# EAGLE design nrf-ethernet (EAGLE 6.4)
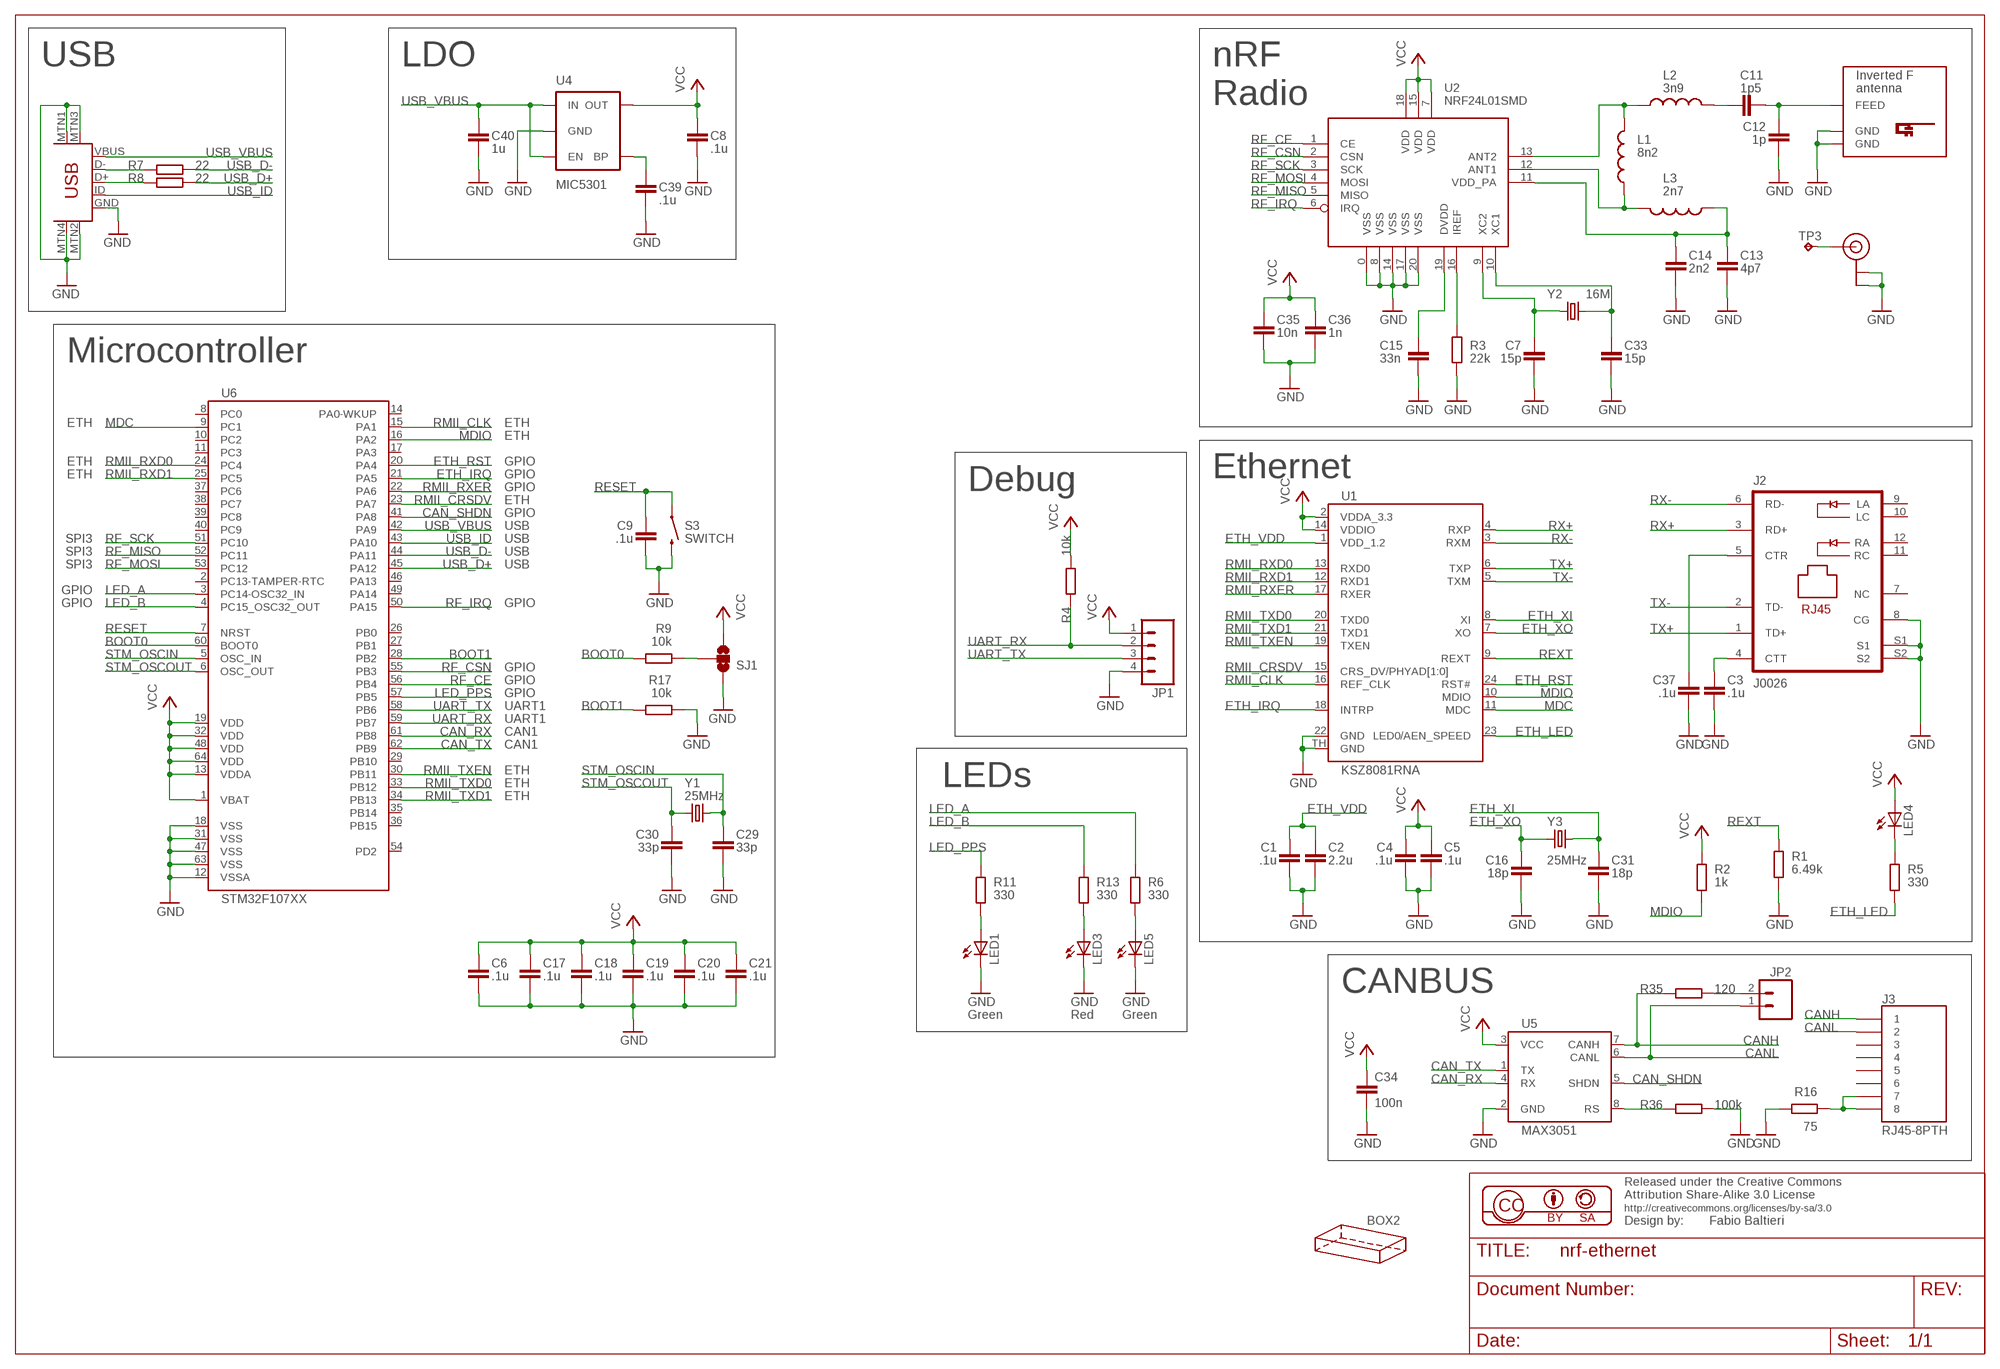
[diagram p0: schematic, sheet 1]

## Parts
BOX2  HAMMOND-BOX-K  [1551K]
C1  .1u  C-EUC0603  [C0603]
C2  2.2u  C-EUC0603  [C0603]
C3  .1u  C-EUC0603  [C0603]
C4  .1u  C-EUC0603  [C0603]
C5  .1u  C-EUC0603  [C0603]
C6  .1u  C-EUC0603  [C0603]
C7  15p  C-EUC0603  [C0603]
C8  .1u  C-EUC0603  [C0603]
C9  .1u  C-EUC0603  [C0603]
C11  1p5  C-EUC0603  [C0603]
C12  1p  C-EUC0603  [C0603]
C13  4p7  C-EUC0603  [C0603]
C14  2n2  C-EUC0603  [C0603]
C15  33n  C-EUC0603  [C0603]
C16  18p  C-EUC0603  [C0603]
C17  .1u  C-EUC0603  [C0603]
C18  .1u  C-EUC0603  [C0603]
C19  .1u  C-EUC0603  [C0603]
C20  .1u  C-EUC0603  [C0603]
C21  .1u  C-EUC0603  [C0603]
C29  33p  C-EUC0603  [C0603]
C30  33p  C-EUC0603  [C0603]
C31  18p  C-EUC0603  [C0603]
C33  15p  C-EUC0603  [C0603]
C34  100n  C-EUC0603  [C0603]
C35  10n  C-EUC0603  [C0603]
C36  1n  C-EUC0603  [C0603]
C37  .1u  C-EUC0603  [C0603]
C39  .1u  C-EUC0603  [C0603]
C40  1u  C-EUC0603  [C0603]
J2  J0026  [PJ-J0]
J3  RJ45-8PTH  [RJ45-8]
JP1  M04PTH  [1X04]
JP2  M02PTH  [1X02]
L1  8n2  INDUCTOR0603  [0603]
L2  3n9  INDUCTOR0603  [0603]
L3  2n7  INDUCTOR0603  [0603]
LED1  LEDCHIPLED_0805  [CHIPLED_0805]
LED3  LEDCHIPLED_0805  [CHIPLED_0805]
LED4  LEDCHIPLED_0805  [CHIPLED_0805]
LED5  LEDCHIPLED_0805  [CHIPLED_0805]
R1  6.49k  R-EU_R0603  [R0603]
R2  1k  R-EU_R0603  [R0603]
R3  22k  R-EU_R0603  [R0603]
R4  10k  R-EU_R0603  [R0603]
R5  330  R-EU_R0603  [R0603]
R6  330  R-EU_R0603  [R0603]
R7  22  R-EU_R0603  [R0603]
R8  22  R-EU_R0603  [R0603]
R9  10k  R-EU_R0603  [R0603]
R11  330  R-EU_R0603  [R0603]
R13  330  R-EU_R0603  [R0603]
R16  75  R-EU_R0805  [R0805]
R17  10k  R-EU_R0603  [R0603]
R35  120  R-EU_R0805  [R0805]
R36  100k  R-EU_R0603  [R0603]
S3  SWITCH  SWITCH-MOMENTARY-2SMD  [TACTILE_SWITCH_SMD]
SJ1  SOLDERJUMPER_2WAYS  [SJ_3]
TP3  TPTP08SQ  [TP08SQ]
U1  KSZ8081RNA  KSZ8081  [QFN24]
U2  NRF24L01SMD  [QFN20]
U4  MIC5301  V_REG_LDOSMD  [SOT23-5]
U5  MAX3051  [SO08]
U6  STM32F107XX  [LQFP64]
U$4  USB-MINIB-5PIN  [USB-MINIB]
U$5  INVERTED_F_ANTENNA-2  [DN007-2]
U$6  U.FL  [U.FL]
Y1  25MHz  CRYSTAL5X3  [CRYSTAL-SMD-5X3]
Y2  16M  CRYSTAL5X3  [CRYSTAL-SMD-5X3]
Y3  25MHz  CRYSTAL5X3  [CRYSTAL-SMD-5X3]

## Nets
BOOT0: R9.2 U6.60(BOOT0)
BOOT1: R17.2 U6.28(PB2)
CAN_RX: U5.4(RX) U6.61(PB8)
CAN_SHDN: U5.5(SHDN) U6.41(PA8)
CAN_TX: U5.1(TX) U6.62(PB9)
CANH: J3.1 R35.1 U5.7(CANH)
CANL: J3.2 JP2.1 U5.6(CANL)
ETH_IRQ: U1.18(INTRP) U6.21(PA5)
ETH_LED: R5.1 U1.23(LED0/AEN_SPEED)
ETH_RST: U1.24(RST#) U6.20(PA4)
ETH_VDD: C1.1 C2.1 U1.1(VDD_1.2)
ETH_XI: C31.1 U1.8(XI) Y3.3
ETH_XO: C16.1 U1.7(XO) Y3.1
GND: C1.2 C2.2 C3.2 C4.2 C5.2 C6.2 C7.2 C8.2 C9.2 C12.2 C13.2 C14.2 C15.2 C16.2 C17.2 C18.2 C19.2 C20.2 C21.2 C29.2 C30.2 C31.2 C33.2 C34.2 C35.2 C36.2 C37.2 C39.2 C40.2 J2.8(CG) J2.S1 J2.S2 JP1.4 LED1.C LED3.C LED5.C R1.1 R3.2 R16.1 R17.1 R36.2 S3.3 SJ1.1 U1.22(GND) U1.TH(GND) U2.0(VSS) U2.8(VSS) U2.14(VSS) U2.17(VSS) U2.20(VSS) U4.2(GND) U5.2(GND) U6.12(VSSA) U6.18(VSS) U6.31(VSS) U6.47(VSS) U6.63(VSS) U$4.GND U$4.MTN1(MTN2) U$4.MTN2(MTN3) U$4.MTN3(MTN1) U$4.MTN4 U$5.GND U$5.GND@1(GND) U$6.P$1(GND) U$6.P$2(GND)
LED_A: R6.2 U6.3(PC14-OSC32_IN)
LED_B: R13.2 U6.4(PC15_OSC32_OUT)
LED_PPS: R11.2 U6.57(PB5)
MDC: U1.11(MDC) U6.9(PC1)
MDIO: R2.1 U1.10(MDIO) U6.16(PA2)
N$1: LED4.C R5.2
N$2: LED1.A R11.1
N$3: L1.2 L3.2 U2.12(ANT1)
N$4: L1.1 L2.1 U2.13(ANT2)
N$6: LED3.A R13.1
N$7: C11.1 L2.2
N$8: C33.1 U2.10(XC1) Y2.3
N$9: C7.1 U2.9(XC2) Y2.1
N$10: C3.1 J2.4(CTT)
N$11: C37.1 J2.5(CTR)
N$12: LED5.A R6.1
N$13: C11.2 C12.1 U$5.FEED
N$14: C13.1 C14.1 L3.1 U2.11(VDD_PA)
N$15: C15.1 U2.19(DVDD)
N$16: R3.1 U2.16(IREF)
N$17: R9.1 SJ1.2
N$19: TP3.TP U$6.P$3(SIGNAL)
N$22: R7.1 U$4.D-
N$25: R36.1 U5.8(RS)
N$26: R8.1 U$4.D+
N$27: JP2.2 R35.2
N$29: J3.7 J3.8 R16.2
N$30: C39.1 U4.4(BP)
RESET: C9.1 S3.1 U6.7(NRST)
REXT: R1.2 U1.9(REXT)
RF_CE: U2.1(CE) U6.56(PB4)
RF_CSN: U2.2(CSN) U6.55(PB3)
RF_IRQ: U2.6(IRQ) U6.50(PA15)
RF_MISO: U2.5(MISO) U6.52(PC11)
RF_MOSI: U2.4(MOSI) U6.53(PC12)
RF_SCK: U2.3(SCK) U6.51(PC10)
RMII_CLK: U1.16(REF_CLK) U6.15(PA1)
RMII_CRSDV: U1.15(CRS_DV/PHYAD[1:0]) U6.23(PA7)
RMII_RXD0: U1.13(RXD0) U6.24(PC4)
RMII_RXD1: U1.12(RXD1) U6.25(PC5)
RMII_RXER: U1.17(RXER) U6.22(PA6)
RMII_TXD0: U1.20(TXD0) U6.33(PB12)
RMII_TXD1: U1.21(TXD1) U6.34(PB13)
RMII_TXEN: U1.19(TXEN) U6.30(PB11)
RX+: J2.3(RD+) U1.4(RXP)
RX-: J2.6(RD-) U1.3(RXM)
STM_OSCIN: C29.1 U6.5(OSC_IN) Y1.3
STM_OSCOUT: C30.1 U6.6(OSC_OUT) Y1.1
TX+: J2.1(TD+) U1.6(TXP)
TX-: J2.2(TD-) U1.5(TXM)
UART_RX: JP1.2 R4.1 U6.59(PB7)
UART_TX: JP1.3 U6.58(PB6)
USB_D+: R8.2 U6.45(PA12)
USB_D-: R7.2 U6.44(PA11)
USB_ID: U6.43(PA10) U$4.ID
USB_VBUS: C40.1 U4.1(IN) U4.3(EN) U6.42(PA9) U$4.VBUS
VCC: C4.1 C5.1 C6.1 C8.1 C17.1 C18.1 C19.1 C20.1 C21.1 C34.1 C35.1 C36.1 JP1.1 LED4.A R2.2 R4.2 SJ1.3 U1.2(VDDA_3.3) U1.14(VDDIO) U2.7(VDD) U2.15(VDD) U2.18(VDD) U4.5(OUT) U5.3(VCC) U6.1(VBAT) U6.13(VDDA) U6.19(VDD) U6.32(VDD) U6.48(VDD) U6.64(VDD)
Unconnected: J2.7(NC) J2.9(LA) J2.10(LC) J2.11(RC) J2.12(RA) J3.3 J3.4 J3.5 J3.6 U6.2(PC13-TAMPER-RTC) U6.8(PC0) U6.10(PC2) U6.11(PC3) U6.14(PA0-WKUP) U6.17(PA3) U6.26(PB0) U6.27(PB1) U6.29(PB10) U6.35(PB14) U6.36(PB15) U6.37(PC6) U6.38(PC7) U6.39(PC8) U6.40(PC9) U6.46(PA13) U6.49(PA14) U6.54(PD2)

## Notes on the sheet
- USB | LDO | nRF
- Radio
- Microcontroller
- ETH | ETH
- ETH
- ETH | GPIO
- ETH | GPIO | Ethernet
- GPIO | Debug
- ETH
- GPIO
- USB
- SPI3 | USB
- SPI3 | USB
- SPI3 | USB
- GPIO
- GPIO | GPIO
- GPIO
- GPIO
- GPIO
- UART1
- UART1
- CAN1
- CAN1
- ETH
- ETH | LEDs
- ETH
- CANBUS
- Green | Red | Green

## Library data of the parts
BOX2 = hammond:HAMMOND-BOX: Hammond Project boxes Hammond 1551 Transluscent Blue 50x35x20mm 1551GTBU http://www.hammondmfg.com/pdf/1551G.pdf Hammond 1551 Transluscent Blue 50x50x20mm 1551RTBU http://www.hammondmfg.com/pdf/1551R.pdf Hammond 1551 Transluscent Blue 60x35x20mm 1551HTBU http://www.hammondmfg.com/pdf/1551H.pdf Hammond 1551 Transluscent Blue 80x40x20mm 1551KTBU http://www.hammondmfg.com/pdf/1551K.pdf Hammond 1591 Transluscent Blue 100x51x22m m 1591XXATBU http://www.hammondmfg.com/pdf/1591XXA.pdf
C1-C9 C11-C21 C29-C31 C33-C37 C39 C40 = rcl:C-EU: CAPACITOR, European symbol
J2 = micrel:J0026: RJ45 PulseJack w/LEDs
J3 = balto:RJ45-8: RJ45 Jack Simple RJ45, 8-pin connection - connector for common Cat5, Cat5e, and Cat6 Ethernet cables. Footprint not yet proven in production. Connector sku is PRT-00643; Breakout PCB sku is BOB-00716.
JP1 = SparkFun-Connectors:M04: Header 4 Standard 4-pin 0.1" header. Use with straight break away headers (SKU : PRT-00116), right angle break away headers (PRT-00553), swiss pins (PRT-00743), machine pins (PRT-00117), and female headers (PRT-00115). Molex polarized connector foot print use with SKU : PRT-08231 with associated crimp pins and housings. 1MM SMD Version SKU: PRT-10208
JP2 = SparkFun-Connectors:M02: Header 2 Standard 2-pin 0.1" header. Use with straight break away headers (SKU : PRT-00116), right angle break away headers (PRT-00553), swiss pins (PRT-00743), machine pins (PRT-00117), and female headers (PRT-00115). Molex polarized connector foot print use with SKU : PRT-08233 with associated crimp pins and housings.
L1-L3 = sparkfun:INDUCTOR: Inductors Basic Inductor/Choke - 0603 and 1206. Footprints are not proven and vary greatly between part numbers.
LED1 LED3-LED5 = led:LED: LED OSRAM: - CHIPLED LG R971, LG N971, LY N971, LG Q971, LY Q971, LO R971, LY R971 LH N974, LH R974 LS Q976, LO Q976, LY Q976 LO Q996 - Hyper CHIPLED LW Q18S LB Q993, LB Q99A, LB R99A - SideLED LS A670, LO A670, LY A670, LG A670, LP A670 LB A673, LV A673, LT A673, LW A673 LH A674 LY A675 LS A676, LA A676, LO A676, LY A676, LW A676 LS A679, LY A679, LG A679 - Hyper Micro SIDELED® LS Y876, LA Y876, LO Y876, LY Y876 LT Y87S - SmartLED LW L88C, LW L88S LB L89C, LB L89S, LG L890 LS L89K, LO L89K, LY L89K LS L896, LA L896, LO L896, LY L896 - TOPLED LS T670, LO T670, LY T670, LG T670, LP T670 LSG T670, LSP T670, LSY T670, LOP T670, LYG T670 LG T671, LOG T671, LSG T671 LB T673, LV T673, LT T673, LW T673 LH T674 LS T676, LA T676, LO T676, LY T676, LB T676, LH T676, LSB T676, LW T676 LB T67C, LV T67C, LT T67C, LS T67K, LO T67K, LY T67K, LW E67C LS E67B, LA E67B, LO E67B, LY E67B, LB E67C, LV E67C, LT E67C LW T67C LS T679, LY T679, LG T679 LS T770, LO T770, LY T770, LG T770, LP T770 LB T773, LV T773, LT T773, LW T773 LH T774 LS E675, LA E675, LY E675, LS T675 LS T776, LA T776, LO T776, LY T776, LB T776 LHGB T686 LT T68C, LB T68C - Hyper Mini TOPLED® LB M676 - Mini TOPLED Santana® LG M470 LS M47K, LO M47K, LY M47K Source: http://www.osram.convergy.de LUXEON: - LUMILED® LXK2-PW12-R00, LXK2-PW12-S00, LXK2-PW14-U00, LXK2-PW14-V00 LXK2-PM12-R00, LXK2-PM12-S00, LXK2-PM14-U00 LXK2-PE12-Q00, LXK2-PE12-R00, LXK2-PE12-S00, LXK2-PE14-T00, LXK2-PE14-U00 LXK2-PB12-K00, LXK2-PB12-L00, LXK2-PB12-M00, LXK2-PB14-N00, LXK2-PB14-P00, LXK2-PB14-Q00 LXK2-PR12-L00, LXK2-PR12-M00, LXK2-PR14-Q00, LXK2-PR14-R00 LXK2-PD12-Q00, LXK2-PD12-R00, LXK2-PD12-S00 LXK2-PH12-R00, LXK2-PH12-S00 LXK2-PL12-P00, LXK2-PL12-Q00, LXK2-PL12-R00 Source: www.luxeon.com KINGBRIGHT: KA-3528ASYC Source: www.kingbright.com
R1-R9 R11 R13 R16 R17 R35 R36 = rcl:R-EU_: RESISTOR, European symbol
S3 = sparkfun:SWITCH-MOMENTARY-2
SJ1 = SparkFun-Passives:SOLDERJUMPER_2WAY: Solder Jumper 2 way solder jumper
TP3 = testpad:TP: Test pad
U1 = balto:KSZ8081: KSZ8081RNA/KSZ8081RND 10Base-T/100Base-TX PHY with RMII Support
U2 = sparkfun:NRF24L01: 2.4GHz Low Power Transceiver This is the very popular, low cost, very low power RF transceiver from Nordic Semiconductor. Simple SPI interface. SKU: COM-00690
U4 = SparkFun-PowerIC:V_REG_LDO: Voltage Regulator LDO Standard 150mA LDO voltage regulator in SOT-23 layout. Micrel part MIC5205. BP (by-pass) pin is used to lower output noise with 470pF cap.
U5 = balto:MAX3051
U6 = balto:STM32F107XX: STM32F107xx Connectivity line, ARM-based 32-bit MCU with 64/256 KB Flash, USB OTG, Ethernet, 10 timers, 2 CANs, 2 ADCs, 14 communication interfaces
U$4 = SparkFun-Connectors:USB-MINIB: Mini-USB "B" connector with 5th pin broken out. Created new symbol breaking out 5th "ID" pin in mini/micro USB connector spec. See: http://en.wikipedia.org/wiki/Mini_usb#Cables. Uses same footprint as 4-pin symbol. Also added pins to connect to mounting / shield pads if required (probably not generally needed as signals aren't shielded once they leave the connector).
U$5 = antenna:INVERTED_F_ANTENNA: 2.4GHz Inverted F Antenna Based on TI Design Note DN007
U$6 = SparkFun-Connectors:U.FL: SMD antenna connector- WRL-09144
Y1-Y3 = sparkfun:CRYSTAL: Crystals Various standard crystals. Proven footprints. Spark Fun Electronics SKU : COM-00534

## Board
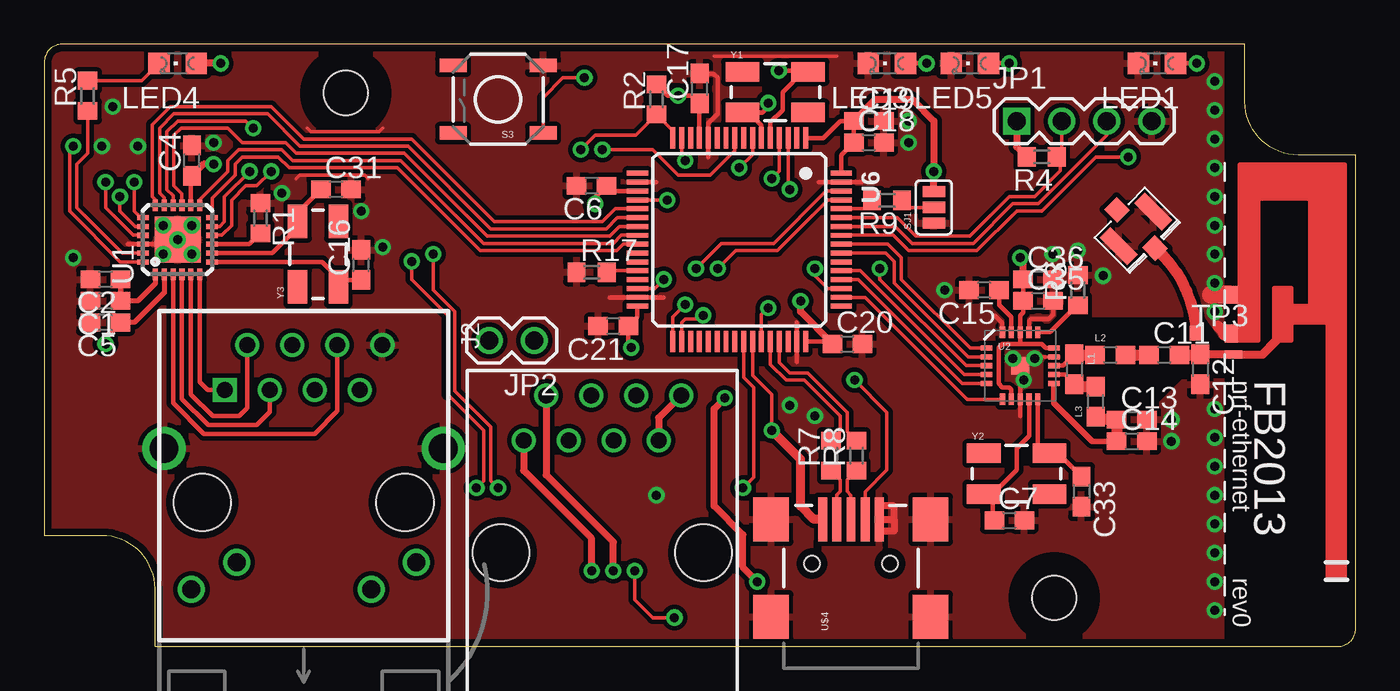
[diagram p1: board, top side]
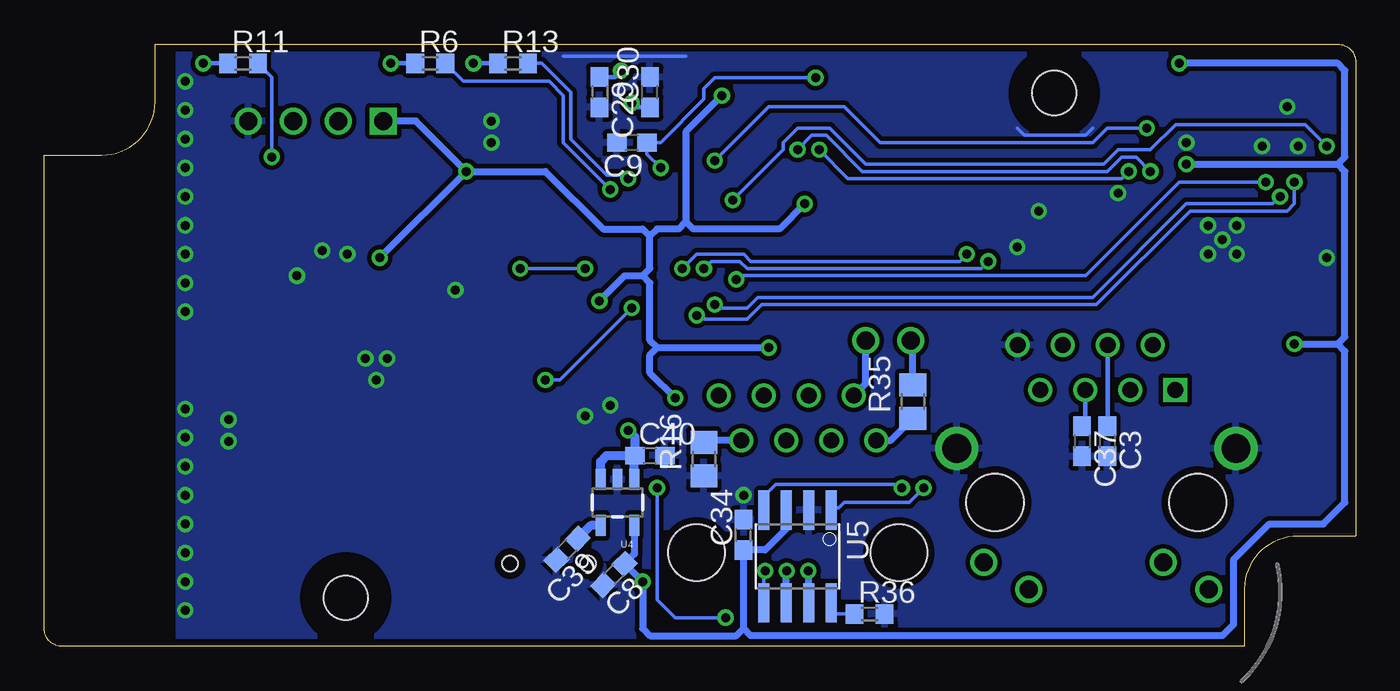
[diagram p2: board, bottom side, seen from below]

Size 74 x 34 mm. Coordinates in mm from the lower left corner, seen from the top.
Copper layers (1*16): Top 0.035mm / dielectric 1.5mm / Bottom 0.035mm
Design rules "balto": minimum track width 8mil, minimum drill 20mil, track to track 8mil, track to pad 8mil, pad to pad 8mil, via to via 8mil, smd to smd 8mil, copper to edge 16mil, drill to drill 8mil, minimum pad ring 8mil, minimum via ring 8mil, stop-mask expansion 2mil, vias tented up to drill 20mil, thermal gap 10mil

### Footprints (pad centres in the part's own frame; a part is rotated, then mirrored left to right if it is on the bottom)
1551K = hole 2.5: 57,2.75; 17,31.25
C0603 = smd 1.1 x 1: 1 -0.85,0; 2 0.85,0
PJ-J0 = drill 0.914 square: 1 4.445,-6.35 | drill 0.914: 2 3.175,-8.89; 3 1.905,-6.35; 4 0.635,-8.89; 5 -0.635,-6.35; 6 -1.905,-8.89; 7 -3.175,-6.35; 8 -4.445,-8.89 | drill 1.016: 9 6.325,4.902; 10 3.785,3.378; 11 -3.81,4.902; 12 -6.35,3.378 | drill 1.626: S1 -7.874,-3.048; S2 7.874,-3.048 | hole 3.251: -5.715,0; 5.715,0
RJ45-8 = drill 0.9: 1 -4.445,6.35; 2 -3.175,8.89; 3 -1.905,6.35; 4 -0.635,8.89; 5 0.635,6.35; 6 1.905,8.89; 7 3.175,6.35; 8 4.445,8.89 | hole 3.2: -5.715,0; 5.715,0
1X04 = drill 1.016 square: 1 0,0 | drill 1.016: 2 2.54,0; 3 5.08,0; 4 7.62,0
1X02 = drill 1.016: 1 0,0; 2 2.54,0
0603 = smd 1.1 x 1: 1 -0.85,0; 2 0.85,0
CHIPLED_0805 = smd 1.2 x 1.2: A 0,-1.05; C 0,1.05
R0603 = smd 1 x 1.1: 1 -0.85,0; 2 0.85,0
R0805 = smd 1.3 x 1.5: 1 -0.95,0; 2 0.95,0
TACTILE_SWITCH_SMD = smd 1.524 x 0.762: 1 -2.54,1.905; 2 2.54,1.905; 3 -2.54,-1.905; 4 2.54,-1.905
SJ_3 = smd 0.635 x 1.27: 1 -0.889,0; 2 0,0; 3 0.889,0
TP08SQ = smd 0.8 x 0.8: TP 0,0
QFN24 = smd 0.65 x 0.29: 1 -1.95,1.25; 2 -1.95,0.75; 3 -1.95,0.25; 4 -1.95,-0.25; 5 -1.95,-0.75; 6 -1.95,-1.25; 13 1.95,-1.25; 14 1.95,-0.75; 15 1.95,-0.25; 16 1.95,0.25; 17 1.95,0.75; 18 1.95,1.25 | smd 0.29 x 0.65: 7 -1.25,-1.95; 8 -0.75,-1.95; 9 -0.25,-1.95; 10 0.25,-1.95; 11 0.75,-1.95; 12 1.25,-1.95; 19 1.25,1.95; 20 0.75,1.95; 21 0.25,1.95; 22 -0.25,1.95; 23 -0.75,1.95; 24 -1.25,1.95 | smd 2.6 x 2.6: TH 0,0
QFN20 = smd 1 x 1: 0 0,0 | smd 0.65 x 0.29: 1 -1.9,1; 2 -1.9,0.5; 3 -1.9,0; 4 -1.9,-0.5; 5 -1.9,-1; 11 1.9,-1; 12 1.9,-0.5; 13 1.9,0; 14 1.9,0.5; 15 1.9,1 | smd 0.29 x 0.65: 6 -1,-1.9; 7 -0.5,-1.9; 8 0,-1.9; 9 0.5,-1.9; 10 1,-1.9; 16 1,1.9; 17 0.5,1.9; 18 0,1.9; 19 -0.5,1.9; 20 -1,1.9
SOT23-5 = smd 0.55 x 1.2: 1 -0.95,-1.3; 2 0,-1.3; 3 0.95,-1.3; 4 0.95,1.3; 5 -0.95,1.3
SO08 = smd 0.61 x 2.21: 1 -1.905,-2.616; 2 -0.635,-2.616; 3 0.635,-2.616; 4 1.905,-2.616; 5 1.905,2.616; 6 0.635,2.616; 7 -0.635,2.616; 8 -1.905,2.616
LQFP64 = smd 0.28 x 1.2: 1 -3.75,-5.75; 2 -3.25,-5.75; 3 -2.75,-5.75; 4 -2.25,-5.75; 5 -1.75,-5.75; 6 -1.25,-5.75; 7 -0.75,-5.75; 8 -0.25,-5.75; 9 0.25,-5.75; 10 0.75,-5.75; 11 1.25,-5.75; 12 1.75,-5.75; 13 2.25,-5.75; 14 2.75,-5.75; 15 3.25,-5.75; 16 3.75,-5.75; 33 3.75,5.75; 34 3.25,5.75; 35 2.75,5.75; 36 2.25,5.75; 37 1.75,5.75; 38 1.25,5.75; 39 0.75,5.75; 40 0.25,5.75; 41 -0.25,5.75; 42 -0.75,5.75; 43 -1.25,5.75; 44 -1.75,5.75; 45 -2.25,5.75; 46 -2.75,5.75; 47 -3.25,5.75; 48 -3.75,5.75 | smd 1.2 x 0.28: 17 5.75,-3.75; 18 5.75,-3.25; 19 5.75,-2.75; 20 5.75,-2.25; 21 5.75,-1.75; 22 5.75,-1.25; 23 5.75,-0.75; 24 5.75,-0.25; 25 5.75,0.25; 26 5.75,0.75; 27 5.75,1.25; 28 5.75,1.75; 29 5.75,2.25; 30 5.75,2.75; 31 5.75,3.25; 32 5.75,3.75; 49 -5.75,3.75; 50 -5.75,3.25; 51 -5.75,2.75; 52 -5.75,2.25; 53 -5.75,1.75; 54 -5.75,1.25; 55 -5.75,0.75; 56 -5.75,0.25; 57 -5.75,-0.25; 58 -5.75,-0.75; 59 -5.75,-1.25; 60 -5.75,-1.75; 61 -5.75,-2.25; 62 -5.75,-2.75; 63 -5.75,-3.25; 64 -5.75,-3.75
USB-MINIB = smd 2.5 x 0.5: D+ 2.5,0; D- 2.5,0.8; GND 2.5,-1.6; ID 2.5,-0.8; VBUS 2.5,1.6 | smd 2.5 x 2: MTN1 -3,4.5; MTN2 2.5,4.5; MTN3 -3,-4.5; MTN4 2.5,-4.5 | hole 0.9: 0,2.2; 0,-2.2
DN007-2 = smd 0.46 x 1: FEED 2.22,-2.8 | smd 1.01 x 0.74: GND -1.16,-2.93; GND@1 1.035,-2.93
U.FL = smd 2.2 x 0.85: P$1 0,1.375; P$2 0,-1.375 | smd 1.05 x 1: P$3 1.525,0; P$4 -1.525,0
CRYSTAL-SMD-5X3 = smd 1.9 x 1.1: 1 -1.85,-1.15; 2 1.85,-1.15; 3 1.85,1.15; 4 -1.85,1.15

### Placement (x,y rotation side)
BOX2  0,0 0 top
C1  3.45,19.51 180 top
C2  3.45,20.73 180 top
C3  14.02,11.58 270 bottom
C4  8.33,27.43 90 top
C5  3.45,18.29 180 top
C6  30.89,26.01 180 top
C7  54.46,7.11 0 top
C8  41.86,4.06 225 bottom
C9  40.84,28.45 180 bottom
C11  63.2,16.46 0 top
C12  65.23,15.65 270 top
C13  61.37,12.8 0 top
C14  61.37,11.58 0 top
C15  53.04,20.12 180 top
C16  17.88,21.54 90 top
C17  36.98,31.5 90 top
C18  46.53,28.45 0 top
C19  46.53,29.67 0 top
C20  45.31,17.07 0 top
C21  32.11,18.08 180 top
C29  42.67,31.29 270 bottom
C30  39.83,31.29 90 bottom
C31  16.46,25.81 0 top
C33  58.52,8.74 270 top
C34  34.54,6.3 90 bottom
C35  56.08,19.51 0 top
C36  56.08,20.73 0 top
C37  15.44,11.58 270 bottom
C39  44.5,5.49 225 bottom
C40  39.83,10.77 0 bottom
J2  14.63,8.13 180 top
J3  31.5,5.28 0 top
JP1  54.86,29.67 0 top
JP2  27.64,17.27 180 top
L1  58.12,15.65 270 top
L2  60.15,16.46 0 top
L3  59.33,13.82 90 top
LED1  62.79,32.92 90 top
LED3  47.55,32.92 90 top
LED4  7.52,32.92 90 top
LED5  52.22,32.92 90 top
R1  12.19,24.18 270 top
R2  34.54,30.89 90 top
R3  58.32,20.12 90 top
R4  56.29,27.64 180 top
R5  2.44,31.09 90 top
R6  52.22,32.92 0 bottom
R7  44.4,10.77 90 top
R8  45.82,10.77 90 top
R9  47.55,25.2 180 top
R11  62.79,32.92 0 bottom
R13  47.55,32.92 0 bottom
R16  36.78,10.57 90 bottom
R17  30.89,21.13 0 top
R35  24.99,13.82 90 bottom
R36  27.43,1.83 0 bottom
S3  25.6,30.89 180 top
SJ1  50.19,24.79 90 top
TP3  65.02,17.68 0 top
U1  7.52,22.96 90 top
U2  55.07,15.85 0 top
U4  41.66,8.13 180 bottom
U5  31.5,5.08 180 bottom
U6  39.22,22.96 180 top
U$4  45.52,4.67 90 top
U$5  69.9,18.69 270 top
U$6  61.6,23.57 315 top
Y1  41.25,31.29 0 top
Y2  54.86,9.75 0 top
Y3  15.44,22.15 90 top

### Tracks (layer width: path | path; a pad name or v marks a point on that pad's centre or on a via)
BOOT0
  Top 0.203: U6.60 46.21,24.71 R9.2
BOOT1
  Top 0.203: U6.28 31.82,21.21 R17.2
CAN_RX  (via drill 0.51)
  Top 0.203: U6.61 44.21,25.21 41.35,22.35 39.01,22.35 v38,21.34 | v25.6,8.94 25.2,9.35 25.2,12.39 23.16,14.43 23.16,18.9 21.95,20.12 v21.95,22.15
  Bottom 0.203: U5.4 33.4,8.46 32.72,9.14 25.81,9.14 v25.6,8.94 | v21.95,22.15 22.35,21.74 34.14,21.74 34.54,22.15 37.19,22.15 v38,21.34
CAN_SHDN  (via drill 0.51)
  Top 0.203: U6.41 39.47,15.19 40.03,14.63 40.03,9.55 v39.42,8.94 | v33.33,4.27 33.33,2.64 34.34,1.63 v35.56,1.63
  Bottom 0.203: v39.42,8.94 39.42,2.64 38.41,1.63 v35.56,1.63 | U5.5 33.4,4.19 v33.33,4.27
CAN_TX  (via drill 0.51)
  Top 0.203: U6.62 44.1,25.71 41.15,22.76 38.2,22.76 v36.78,21.34 | v24.38,8.94 24.79,9.35 24.79,12.19 22.76,14.22 22.76,18.69 20.73,20.73 v20.73,21.74
  Bottom 0.203: U5.1 29.46,7.82 29.16,7.82 28.85,8.13 25.2,8.13 v24.38,8.94 | v20.73,21.74 21.13,21.34 34.34,21.34 34.75,21.74 36.37,21.74 v36.78,21.34
CANH  (via drill 0.51)
  Top 0.406: v30.89,4.27 30.89,6.1 27.05,9.93 J3.1
  Bottom 0.406: U5.7 30.86,4.24 v30.89,4.27 | J3.1 26.23,11.63 R35.1
CANL  (via drill 0.51)
  Top 0.406: v32.11,4.27 32.11,5.89 28.32,9.68 J3.2
  Bottom 0.406: U5.6 32.13,4.24 v32.11,4.27 | J3.2 27.64,14.86 JP2.1
ETH_IRQ
  Top 0.203: U1.18 6.27,25.23 6.1,25.4 6.1,29.46 7.11,30.48 12.8,30.48 14.63,28.65 20.73,28.65 25.4,23.98 31.5,23.98 32.23,24.71 U6.21
ETH_LED
  Top 0.203: U1.23 4.41,22.21 1.83,24.79 1.83,27.23 2.44,27.84 R5.1
ETH_RST  (via drill 0.51)
  Top 0.203: U1.24 4.3,21.71 1.42,24.59 1.42,28.04 v1.63,28.25 | U6.20 35.14,25.21 v35.15,25.2
  Bottom 0.203: v1.63,28.25 2.85,29.46 10.16,29.46 11.58,28.04 13.41,28.04 14.22,27.23 27.64,27.23 29.67,29.26 31.5,29.26 32.31,28.45 32.31,28.04 v35.15,25.2
ETH_VDD
  Top 0.279: U1.1 6.27,20.49 5.28,19.51 C1.1
  Top 0.305: C1.1 C2.1 | U1.1 6.27,20.9
ETH_XI
  Top 0.254: U1.8 12.86,22.21 14.29,23.64 Y3.3 14.29,24.49 C31.1
ETH_XO
  Top 0.254: U1.7 15.68,21.71 16.59,20.8 Y3.1 | Y3.1 16.59,19.98 | C16.1 16.98,20.69 Y3.1
GND  (via drill 0.51)
  Top 0.203: U2.14 55.97,16.35 | 14.83,29.26 15.04,29.06 18.9,29.06 19.1,29.26 | 18.29,26.42 18.09,26.62 14.43,26.62 14.22,26.42 | 37.8,33.33 44.7,33.33
  Top 0.25: U6.31 | U6.63 | U6.47
  Top 0.254: U2.20 54.07,18.27 53.65,18.69 | U2.17 55.57,18.38 55.68,18.49 56.69,18.49 56.93,18.73 C35.2 | 55.07,14.83 U2.8 55.07,13.01 | v6.71,22.15 6.71,22.46 6.46,22.71 U1.22 4.72,22.71 | 37.47,27.64 U6.12 37.47,29.54 38,30.07 38,32.11 37.76,32.35 C17.2 | U6.18 34.54,26.21 | U6.31 34.95,19.71 | U6.63 43.69,26.21 | U6.47 42.47,18.29 | U6.31 31.9,19.71 | U6.63 46.13,26.21 | U6.47 42.47,16.05
  Top 0.406: U$4.GND 47.95,7.17 | 47.95,7.17 47.95,7.92 47.14,7.92 | 47.95,7.17 47.95,6.5 47.14,6.5
  Top 0.61: 66.65,17.66 66.24,18.07
  Top 0.813: U$5.GND@1 66.65,17.66
  Top 1.016: U$5.GND 65.84,19.85
  Bottom 0.203: 19.1,29.26 18.69,28.85 15.24,28.85 14.83,29.26 | 44.7,33.33 37.8,33.33
  other vias: 54.66,16.26 55.88,16.26 55.27,15.04 6.71,23.77 8.33,22.15 7.52,22.96 8.33,23.77 3.25,28.24 43.48,13 42.06,13.61 17.88,24.59 13.41,25.6 9.55,28.45 5.28,28.24 3.86,30.48 48.77,29.67 48.77,28.45 50.8,20.12 66.04,13.41 66.04,11.79 66.04,10.16 66.04,8.53 66.04,6.91 66.04,5.28 66.04,3.66 66.04,2.03 66.04,18.9 66.04,20.52 66.04,22.15 66.04,23.77 66.04,25.4 66.04,27.03 66.04,28.65 66.04,30.28 66.04,31.9 63.6,12.8 63.6,11.58 58.32,22.35 56.9,22.15 59.74,20.93 1.63,21.95 19.1,22.56 34.54,8.53
  pour Top (isolate 0.254): -0.81,-0.81 75.18,-0.81 75.18,34.75 -0.81,34.75
  pour Bottom (isolate 0.254): -0.41,-0.41 74.78,-0.41 74.78,34.34 -0.41,34.34
  pour Top (no thermals): 54.05,14.83 54.05,16.87 56.08,16.87 56.08,14.83
LED_A  (via drill 0.51)
  Top 0.203: U6.3 41.97,25.9 v42.06,25.81
  Bottom 0.203: R6.2 50.36,31.9 45.52,31.9 44.7,31.09 44.7,28.45 v42.06,25.81
LED_B  (via drill 0.51)
  Top 0.203: U6.4 41.47,26.84 v41.05,26.42
  Bottom 0.203: R13.2 45.92,32.92 44.3,31.29 44.3,28.65 42.27,26.62 41.25,26.62 v41.05,26.42
LED_PPS  (via drill 0.51)
  Top 0.203: U6.57 47.91,23.21 48.77,22.35 52.63,22.35 54.86,24.59 56.29,24.59 59.33,27.64 v61.16,27.64
  Bottom 0.203: v61.16,27.64 61.16,32.14 R11.2
MDC  (via drill 0.51)
  Top 0.203: U1.11 9.89,23.71 10.16,23.98 10.16,25.4 v11.58,26.82 | U6.9 38.97,28 37.59,26.62 35.76,26.62 34.34,28.04 v31.5,28.04
  Bottom 0.203: v11.58,26.82 12.39,27.64 13.21,27.64 14.02,26.82 27.84,26.82 29.87,28.85 30.68,28.85 v31.5,28.04
MDIO  (via drill 0.51)
  Top 0.203: U1.10 10,23.21 10.57,23.77 10.57,25.2 11.38,26.01 11.99,26.01 v12.8,26.82 | U6.16 35.47,29.11 R2.1 33.36,28.85 31.09,28.85 v30.28,28.04
  Bottom 0.203: v12.8,26.82 13.21,26.42 28.65,26.42 v30.28,28.04
N$1
  Top 0.203: LED4.C 5.49,31.94 R5.2
N$2  (via drill 0.51)
  Top 0.254: v65.02,32.92 LED1.A
  Bottom 0.254: R11.1 v65.02,32.92
N$3
  Top 0.254: U2.12 57.6,15.35 58.12,14.83 L1.2
  Top 0.61: L1.2 58.24,14.67 L3.2
N$4
  Top 0.254: U2.13 57.51,15.85 58.12,16.46 L1.1
  Top 0.61: L1.1 58.15,16.46 L2.1
N$6  (via drill 0.51)
  Top 0.254: LED3.A v49.78,32.92
  Bottom 0.254: v49.78,32.92 R13.1
N$7
  Top 0.61: L2.2 C11.1
N$8
  Top 0.254: U2.10 56.07,11.14 56.31,10.9 Y2.3 57.21,10.9 C33.1
N$9
  Top 0.254: U2.9 55.57,11.88 54.86,11.18 54.86,9.96 53.51,8.6 | 53.51,8.6 Y2.1 52.7,8.6 | 53.51,8.6 53.51,7.21 C7.1
N$10
  Bottom 0.25: J2.4 13.99,12.46 C3.1
N$11
  Bottom 0.25: J2.5 15.27,12.61 C37.1
N$12  (via drill 0.51)
  Top 0.254: v54.46,32.92 LED5.A
  Bottom 0.254: R6.1 v54.46,32.92
N$13
  Top 0.46: U$5.FEED 65.25,16.47 C12.1
  Top 0.61: C11.2 65.19,16.46 C12.1
N$14
  Top 0.305: C14.1 59.13,11.58 56.97,13.75 U2.11
  Top 0.61: L3.1 59.5,12.8 C13.1 C14.1
N$15
  Top 0.254: C15.1 53.88,19.27 54.57,18.59 U2.19
N$16
  Top 0.254: U2.16 56.76,17.75 58.28,19.27 R3.1
N$17
  Top 0.203: SJ1.2 48.8,24.79 R9.1
N$19
  Top 0.61: TP3.TP arc46 U$6.P$3
N$20
  cutout Top: 57.71,18.49 57.71,13.41 62.38,13.41 64.21,15.24 66.7,15.24 66.7,-0.41 74.17,-0.41 74.17,34.14 66.7,34.14 66.7,17.07 66.45,17.07 65.43,18.49
N$22
  Top 0.203: U$4.D- 44.72,8.55 44.91,8.74 44.91,9.41 R7.1
N$25
  Bottom 0.203: R36.1 29.46,1.83 29.46,2.34 U5.8
  Bottom 0.406: U5.8 29.59,3.09
N$26
  Top 0.203: U$4.D+ 45.52,8.53 45.31,8.74 45.31,9.41 R8.1
N$27
  Bottom 0.406: R35.2 24.99,17.17 JP2.2
N$29
  Top 0.406: J3.8 34.67,12.9 J3.7
  Bottom 0.406: J3.7 36.66,11.63 R16.2
N$30
  Bottom 0.508: U4.4 43.16,6.83 C39.1
N$44
  cutout Bottom: 66.7,34.14 74.17,34.14 74.17,-0.41 66.7,-0.41
RESET  (via drill 0.51)
  Top 0.203: S3.1 28.14,30.99 29.26,32.11 v30.48,32.11 | v39.22,27.03 39.97,27.78 U6.7
  Bottom 0.203: v30.48,32.11 36.17,32.11 36.78,31.5 36.78,30.89 39.22,28.45 C9.1 39.99,27.8 v39.22,27.03
REXT
  Top 0.254: U1.9 11.57,22.71 R1.2
RF_CE
  Top 0.203: U6.56 47.6,22.71 48.36,21.95 48.36,20.73 52.24,16.85 U2.1
RF_CSN
  Top 0.203: U6.55 47.49,22.21 47.95,21.74 47.95,20.52 52.13,16.35 U2.2
RF_IRQ
  Top 0.203: U6.50 46.33,19.71 52.09,13.95 U2.6
RF_MISO
  Top 0.203: U6.52 45.94,20.71 51.8,14.85 U2.5
RF_MOSI
  Top 0.203: U6.53 46.05,21.21 51.91,15.35 U2.4
RF_SCK  (via drill 0.51)
  Top 0.203: U6.51 44.2,20.21 43.48,20.93 v43.48,21.34 | v47.14,21.34 47.14,20.73 52.02,15.85 U2.3
  Bottom 0.203: v43.48,21.34 v47.14,21.34
RMII_CLK  (via drill 0.51)
  Top 0.203: U1.16 7.27,25.45 6.91,25.81 6.91,29.06 7.52,29.67 11.38,29.67 v11.79,29.26 | U6.15 35.97,27.63 v36.17,27.43
  Bottom 0.203: v11.79,29.26 14.02,29.26 14.83,28.45 26.82,28.45 28.85,30.48 33.12,30.48 v36.17,27.43
RMII_CRSDV
  Top 0.203: U1.15 7.77,25.56 7.32,26.01 7.32,28.85 7.72,29.26 10.36,29.26 11.18,28.45 13.61,28.45 14.22,27.84 20.32,27.84 24.99,23.16 31.9,23.16 32.45,23.71 U6.23
RMII_RXD0
  Top 0.203: U1.13 8.77,25.23 10.36,26.82 10.36,27.43 10.97,28.04 13.41,28.04 14.02,27.43 20.12,27.43 24.79,22.76 32.11,22.76 32.56,23.21 U6.24
RMII_RXD1
  Top 0.203: U1.12 9.47,25.32 10.77,26.62 10.77,27.23 11.18,27.64 13.21,27.64 13.82,27.03 19.91,27.03 24.59,22.35 32.31,22.35 32.67,22.71 U6.25
RMII_RXER
  Top 0.203: U1.17 6.77,25.34 6.5,25.6 6.5,29.26 7.32,30.07 12.6,30.07 14.43,28.25 20.52,28.25 25.2,23.57 31.7,23.57 32.34,24.21 U6.22
RMII_TXD0  (via drill 0.51)
  Top 0.203: U1.20 5.14,23.71 4.27,24.59 v4.27,25.4 | U6.33 35.47,18.6 v36.17,19.3
  Bottom 0.203: v4.27,25.4 4.67,24.99 9.55,24.99 14.83,19.71 33.73,19.71 34.34,19.1 35.97,19.1 v36.17,19.3
RMII_TXD1  (via drill 0.51)
  Top 0.203: U1.21 5.03,23.21 3.45,24.79 v3.45,26.21 | U6.34 35.97,18.29 36.17,18.49 36.98,18.49 v37.19,18.69
  Bottom 0.203: v3.45,26.21 3.45,24.99 3.86,24.59 9.35,24.59 14.63,19.3 33.53,19.3 34.34,18.49 36.98,18.49 v37.19,18.69
RMII_TXEN  (via drill 0.51)
  Top 0.203: U1.19 5.46,24.21 5.08,24.59 v5.08,26.21 | U6.30 34.44,20.21 v34.95,20.73
  Bottom 0.203: v5.08,26.21 9.96,26.21 15.24,20.93 34.75,20.93 v34.95,20.73
RX+
  Top 0.25: U1.4 7.77,13.98 9.25,12.5 12,12.5 12.72,13.22 J2.3
RX-
  Top 0.25: U1.3 7.27,13.73 9,12 15.25,12 16.54,13.29 J2.6
STM_OSCIN  (via drill 0.51)
  Top 0.254: U6.5 40.97,29.59 41.66,30.28 41.66,31.29 42.81,32.44 Y1.3 43.03,32.51 v41.45,32.51
  Bottom 0.254: C29.1 41.82,32.14 v41.45,32.51
STM_OSCOUT  (via drill 0.51)
  Top 0.254: v40.84,30.68 40.84,30.48 40.51,30.14 Y1.1 39.76,30.14 40.47,29.43 U6.6
  Bottom 0.254: C30.1 40.6,30.44 v40.84,30.68
TX+
  Top 0.25: U1.6 8.77,14.94 9.22,14.48 J2.1
TX-
  Top 0.25: U1.5 8.27,14.23 9.5,13 11,13 11.46,13.46 J2.2
UART_RX
  Top 0.203: U6.59 48.13,24.21 49.17,23.16 52.22,23.16 54.46,25.4 55.88,25.4 57.34,26.86 57.34,27.43 R4.1 57.4,27.9 JP1.2
UART_TX
  Top 0.203: U6.58 48.02,23.71 48.97,22.76 52.43,22.76 54.66,24.99 56.08,24.99 59.94,28.85 JP1.3
USB_D+
  Top 0.203: R8.2 45.31,12.13 45.31,13.21 43.08,15.44 42.06,15.44 41.47,16.04 U6.45
USB_D-
  Top 0.203: R7.2 44.91,12.13 44.91,13.01 42.88,15.04 41.86,15.04 40.97,15.93 U6.44
USB_ID  (via drill 0.51)
  Top 0.203: U$4.ID 46.32,8.72 47.55,9.96 47.55,13.21 v45.72,15.04 | U6.43 40.47,18.73 v40.84,19.1
  Bottom 0.203: v45.72,15.04 44.91,15.04 v40.84,19.1
USB_VBUS  (via drill 0.51)
  Top 0.203: U6.42 39.97,15.3 41.05,14.22 v41.05,12.19
  Top 0.508: U$4.VBUS 43.42,7.17 42.67,7.92 42.67,10.57 v41.05,12.19
  Bottom 0.508: v41.05,12.19 40.68,11.82 C40.1 | U4.1 40.71,10.74 C40.1 | U4.3 42.61,10.43 42.27,10.77 C40.1
VCC  (via drill 0.51)
  Top 0.254: 55.07,17.07 U2.18 55.07,18.69 55.23,18.86 C35.1 C36.1 | 55.07,17.07 56.29,17.07 56.51,16.85 U2.15 | 55.07,17.07 54.05,17.07 53.85,16.87 53.85,14.83 54.05,14.63 54.46,14.63 54.57,14.52 U2.7 | U1.14 8.27,26.52 C4.1 | U6.1 43.95,28.71 44.91,29.67 C19.1 | U6.64 44.97,27.73 C18.1 C19.1 | R2.2 35.19,31.09 v35.76,31.09 36.54,31.09 C17.1 36.97,30.63 U6.13 | 45.72,29.7 C19.1 | U6.32 33.47,18.6 C21.1 32.96,17.03 v33.12,16.87 | U6.48 44.32,17.21 C20.1 | U6.19 32.03,25.71 C6.1 31.09,25.36 v31.09,24.99
  Top 0.279: U1.2 6.77,19.98 5.08,18.29 C5.1
  Top 0.305: C5.1 3.45,17.44 v3.45,17.07
  Top 0.406: v40.23,3.66 39.42,4.47 39.42,6.3 37.8,7.92 37.8,13.41 v38.41,14.02 | v9.55,27.23 8.98,27.23 C4.1 | C20.1 44.46,17.11 42.67,18.9 v42.67,19.51 | JP1.1 54.86,28.21 R4.2 | SJ1.3 v50.19,26.82 50.19,29.67 48.97,30.89 46.9,30.89 C19.1 | C36.1 55.23,21.78 v55.07,21.95 | v9.96,32.92 LED4.A
  Bottom 0.406: 34.54,1.02 34.14,0.61 7.52,0.61 6.91,1.22 6.91,4.88 4.88,6.91 1.83,6.91 0.61,8.13 0.61,16.66 1.02,17.07 | 34.54,1.02 34.95,0.61 39.83,0.61 40.23,1.02 v40.23,3.66 41.24,4.67 C8.1 40.71,5.22 U4.5 | 1.02,27.23 0.61,26.82 0.61,17.48 1.02,17.07 | 1.02,27.23 0.61,27.64 0.61,32.51 1.02,32.92 v9.96,32.92 | v3.45,17.07 1.02,17.07 | v9.55,27.23 1.02,27.23 | 34.54,1.02 C34.1 33.33,5.45 32.13,6.64 U5.3 | v38.41,14.02 39.83,15.44 39.83,16.46 39.42,16.87 | 39.42,16.87 39.83,17.27 39.83,20.52 40.23,20.93 | v31.09,24.99 32.51,23.57 37.39,23.57 37.8,23.98 | v35.76,31.09 37.8,29.06 37.8,23.98 | 37.8,23.98 38.2,23.57 39.42,23.57 39.83,23.16 | v42.67,19.51 41.25,20.93 40.23,20.93 | 40.23,20.93 39.83,21.34 39.83,23.16 | v50.19,26.82 45.72,26.82 42.47,23.57 40.23,23.57 39.83,23.16 | v50.19,26.82 53.03,29.67 JP1.1 | 39.42,16.87 v33.12,16.87 | v50.19,26.82 v55.07,21.95

### Text on the board
_tsilk: nrf-ethernet | FB2013 | rev0